# EAGLE design AdaFruit BNO055 (EAGLE 9.3.0)
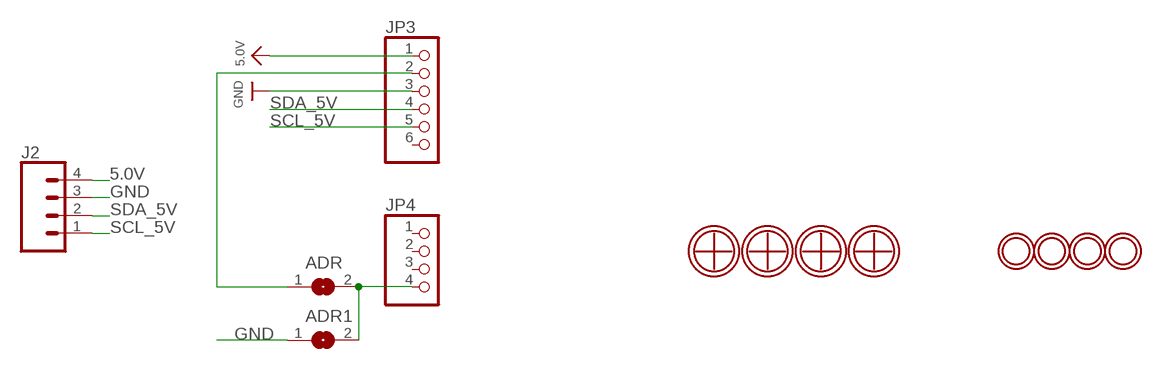
[diagram p0: schematic, sheet 1]

## Parts
ADR  SOLDERJUMPERREFLOW  [SOLDERJUMPER_REFLOW]
ADR1  SOLDERJUMPERREFLOW  [SOLDERJUMPER_REFLOW]
J2  CONN_04  [1X04]
JP3  HEADER-1X676MIL  [1X06_ROUND_76]
JP4  HEADER-1X476MIL  [1X04_ROUND_76]
U$1  3.2MM-5MM  [3.2MM-5MM]
U$3  3.2MM-5MM  [3.2MM-5MM]
U$4  3.2MM-5MM  [3.2MM-5MM]
U$5  3.2MM-5MM  [3.2MM-5MM]
U$7  MOUNTINGHOLE2.5_THICK  [MOUNTINGHOLE_2.5_PLATED_THICK]
U$8  MOUNTINGHOLE2.5_THICK  [MOUNTINGHOLE_2.5_PLATED_THICK]
U$9  MOUNTINGHOLE2.5_THICK  [MOUNTINGHOLE_2.5_PLATED_THICK]
U$11  MOUNTINGHOLE2.5_THICK  [MOUNTINGHOLE_2.5_PLATED_THICK]

## Nets
5.0V: J2.4 JP3.1
GND: ADR1.1 J2.3 JP3.3
N$1: ADR1.2 ADR.2 JP4.4
N$2: ADR.1 JP3.2
SCL_5V: J2.1 JP3.5
SDA_5V: J2.2 JP3.4
Unconnected: JP3.6 JP4.1 JP4.2 JP4.3 U$1.P$1 U$3.P$1 U$4.P$1 U$5.P$1

## Library data of the parts
ADR ADR1 = #microbuilder:SOLDERJUMPER: SMD Solder JUMPER Solder the two pads together to create a connection, or remove the solder to break it. REFLOW - Use this footprint for solder paste and reflow ovens. WAVE - Use this footprint for hand-soldering (larger pads). CLOSED - Has a trace between the two pads to ensure it is closed by default. The trace needs to be cut to disable the jumper, and can be closed again by creating a solder bridge between the two pads.
J2 = SparkFun-Connectors:CONN_04: Multi connection point. Often used as Generic Header-pin footprint for 0.1 inch spaced/style header connections On any of the 0.1 inch spaced packages, you can populate with these: Break Away Headers - Straight <https://www.sparkfun.com/products/116> (PRT-00116) Break Away Male Headers - Right Angle <https://www.sparkfun.com/products/553> (PRT-00553) Female Headers <https://www.sparkfun.com/products/115> (PRT-00115) Break Away Headers - Machine Pin <https://www.sparkfun.com/products/117> (PRT-00117) Break Away Female Headers - Swiss Machine Pin <https://www.sparkfun.com/products/743> (PRT-00743) For SCREWTERMINALS and SPRING TERMINALS visit here: Screw Terimnals on SparkFun.com <https://www.sparkfun.com/search/results?term=Screw+Terminals> (5mm/3.5mm/2.54mm spacing) This device is also useful as a general connection point to wire up your design to another part of your project. Our various solder wires solder well into these plated through hole pads. Hook-Up Wire - Assortment (Stranded, 22 AWG) <https://www.sparkfun.com/products/11375> (PRT-11375) Hook-Up Wire - Assortment (Solid Core, 22 AWG) <https://www.sparkfun.com/products/11367> (PRT-11367) View the entire wire category on our website here <https://www.sparkfun.com/categories/141> Special notes: Molex polarized connector foot print use with SKU : PRT-08231 with associated crimp pins and housings. 1MM SMD Version SKU: PRT-10208; PROD_ID: CONN-09696
JP3 = microbuilder:HEADER-1X6: PIN HEADER
JP4 = microbuilder:HEADER-1X4: PIN HEADER
U$1 U$3-U$5 = #Holes:3.2MM-5MM
U$7-U$9 U$11 = microbuilder:MOUNTINGHOLE: Mounting Hole For #2 screws (0.086"/2.18mm width, 0.094"/2.4mm hole) use 2.5mm; BOM: EXCLUDE

## Board
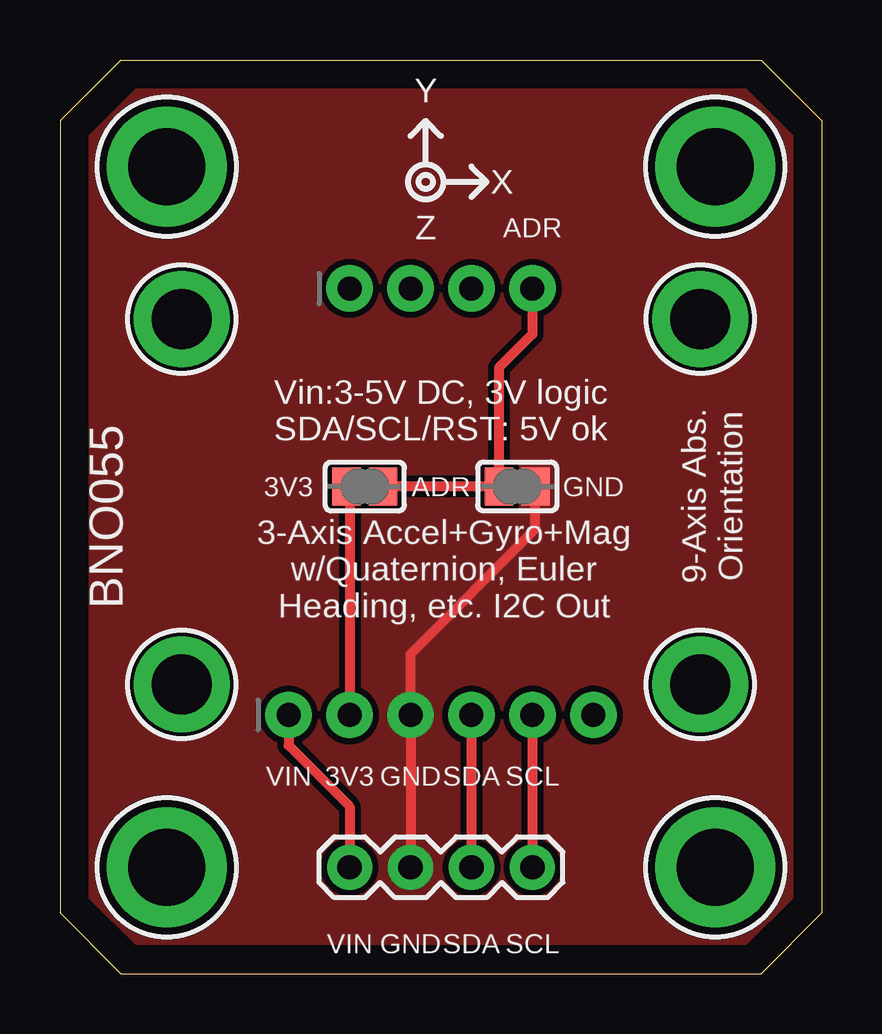
[diagram p1: board, top side]
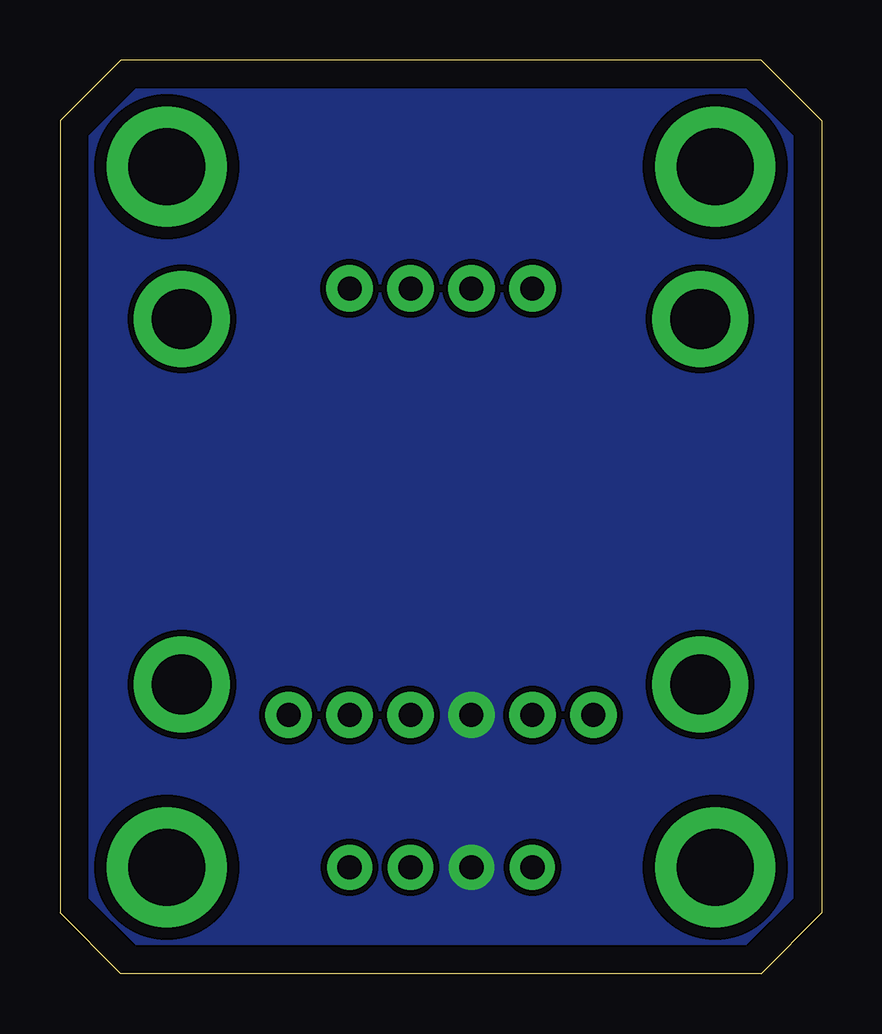
[diagram p2: board, bottom side, seen from below]

Size 31.75 x 38.1 mm. Coordinates in mm from the lower left corner, seen from the top.
Outline: 2.54,38.1 29.21,38.1 31.75,35.56 31.75,2.54 29.21,0 2.54,0 0,2.54 0,35.56 2.54,38.1
Copper layers (1*16): Top 0.035mm / dielectric 1.5mm / Bottom 0.035mm
Design rules "SparkFun 2 Layer Design Rule - STANDARD": minimum track width 10mil, minimum drill 20mil, track to track 10mil, track to pad 8mil, pad to pad 8mil, via to via 10mil, smd to smd 8mil, copper to edge 8mil, drill to drill 8mil, minimum pad ring 10mil, minimum via ring 10mil, stop-mask expansion 4mil, vias tented up to drill 25mil, thermal gap 10mil

### Footprints (pad centres in the part's own frame; a part is rotated, then mirrored left to right if it is on the bottom)
SOLDERJUMPER_REFLOW = smd 1.168 x 1.6: 1 -0.762,0; 2 0.762,0
1X04 = drill 1.016 pad 1.88: 1 0,0; 2 2.54,0; 3 5.08,0; 4 7.62,0
1X06_ROUND_76 = drill 1 pad 1.93: 1 -6.35,0; 2 -3.81,0; 3 -1.27,0; 4 1.27,0; 5 3.81,0; 6 6.35,0
1X04_ROUND_76 = drill 1 pad 1.93: 1 -3.81,0; 2 -1.27,0; 3 1.27,0; 4 3.81,0
3.2MM-5MM = drill 3.2 pad 5: P$1 0,0
MOUNTINGHOLE_2.5_PLATED_THICK = drill 2.5 pad 4: P$1 0,0

### Placement (x,y rotation side)
ADR  12.7,20.32 0 top
ADR1  19.05,20.32 180 top
J2  19.68,4.45 180 top
JP3  15.87,10.79 0 top
JP4  15.87,28.58 0 top
U$1  4.45,4.45 0 top
U$3  27.3,4.45 0 top
U$4  4.45,33.66 0 top
U$5  27.3,33.66 0 top
U$7  5.08,27.3 0 top
U$8  5.08,12.06 0 top
U$9  26.67,27.3 0 top
U$11  26.67,12.06 0 top

### Tracks (layer width: path | path; a pad name or v marks a point on that pad's centre or on a via)
5.0V
  Top 0.406: JP3.1 9.52,9.52 12.07,6.98 J2.4
GND
  Top 0.406: J2.3 JP3.3 14.6,13.34 19.81,18.54 ADR1.1
  pour Top (no thermals): 3.17,36.83 28.57,36.83 30.48,34.92 30.48,3.17 28.57,1.27 3.17,1.27 1.27,3.17 1.27,34.92
  pour Bottom (no thermals): 3.17,36.83 28.57,36.83 30.48,34.92 30.48,3.17 28.57,1.27 3.17,1.27 1.27,3.17 1.27,34.92
N$1
  Top 0.406: JP4.4 19.68,26.67 18.29,25.27 ADR1.2 ADR.2
N$2
  Top 0.406: ADR.1 12.07,20.19 JP3.2
SCL_5V
  Top 0.406: JP3.5 J2.1
SDA_5V
  Top 0.406: JP3.4 J2.2

### Text on the board
tPlace: Y | X | Z | ADR | Vin:3-5V DC, 3V logic / SDA/SCL/RST: 5V ok | 3V3 | GND | 9-Axis Abs. / Orientation | BNO055 | 3-Axis Accel+Gyro+Mag / w/Quaternion, Euler / Heading, etc. I2C Out | VIN | 3V3 | GND | SDA | SCL | VIN | GND | SDA | SCL